# Altium schematic sheet STM32F407VG.SchDoc
size 381 x 241 mm
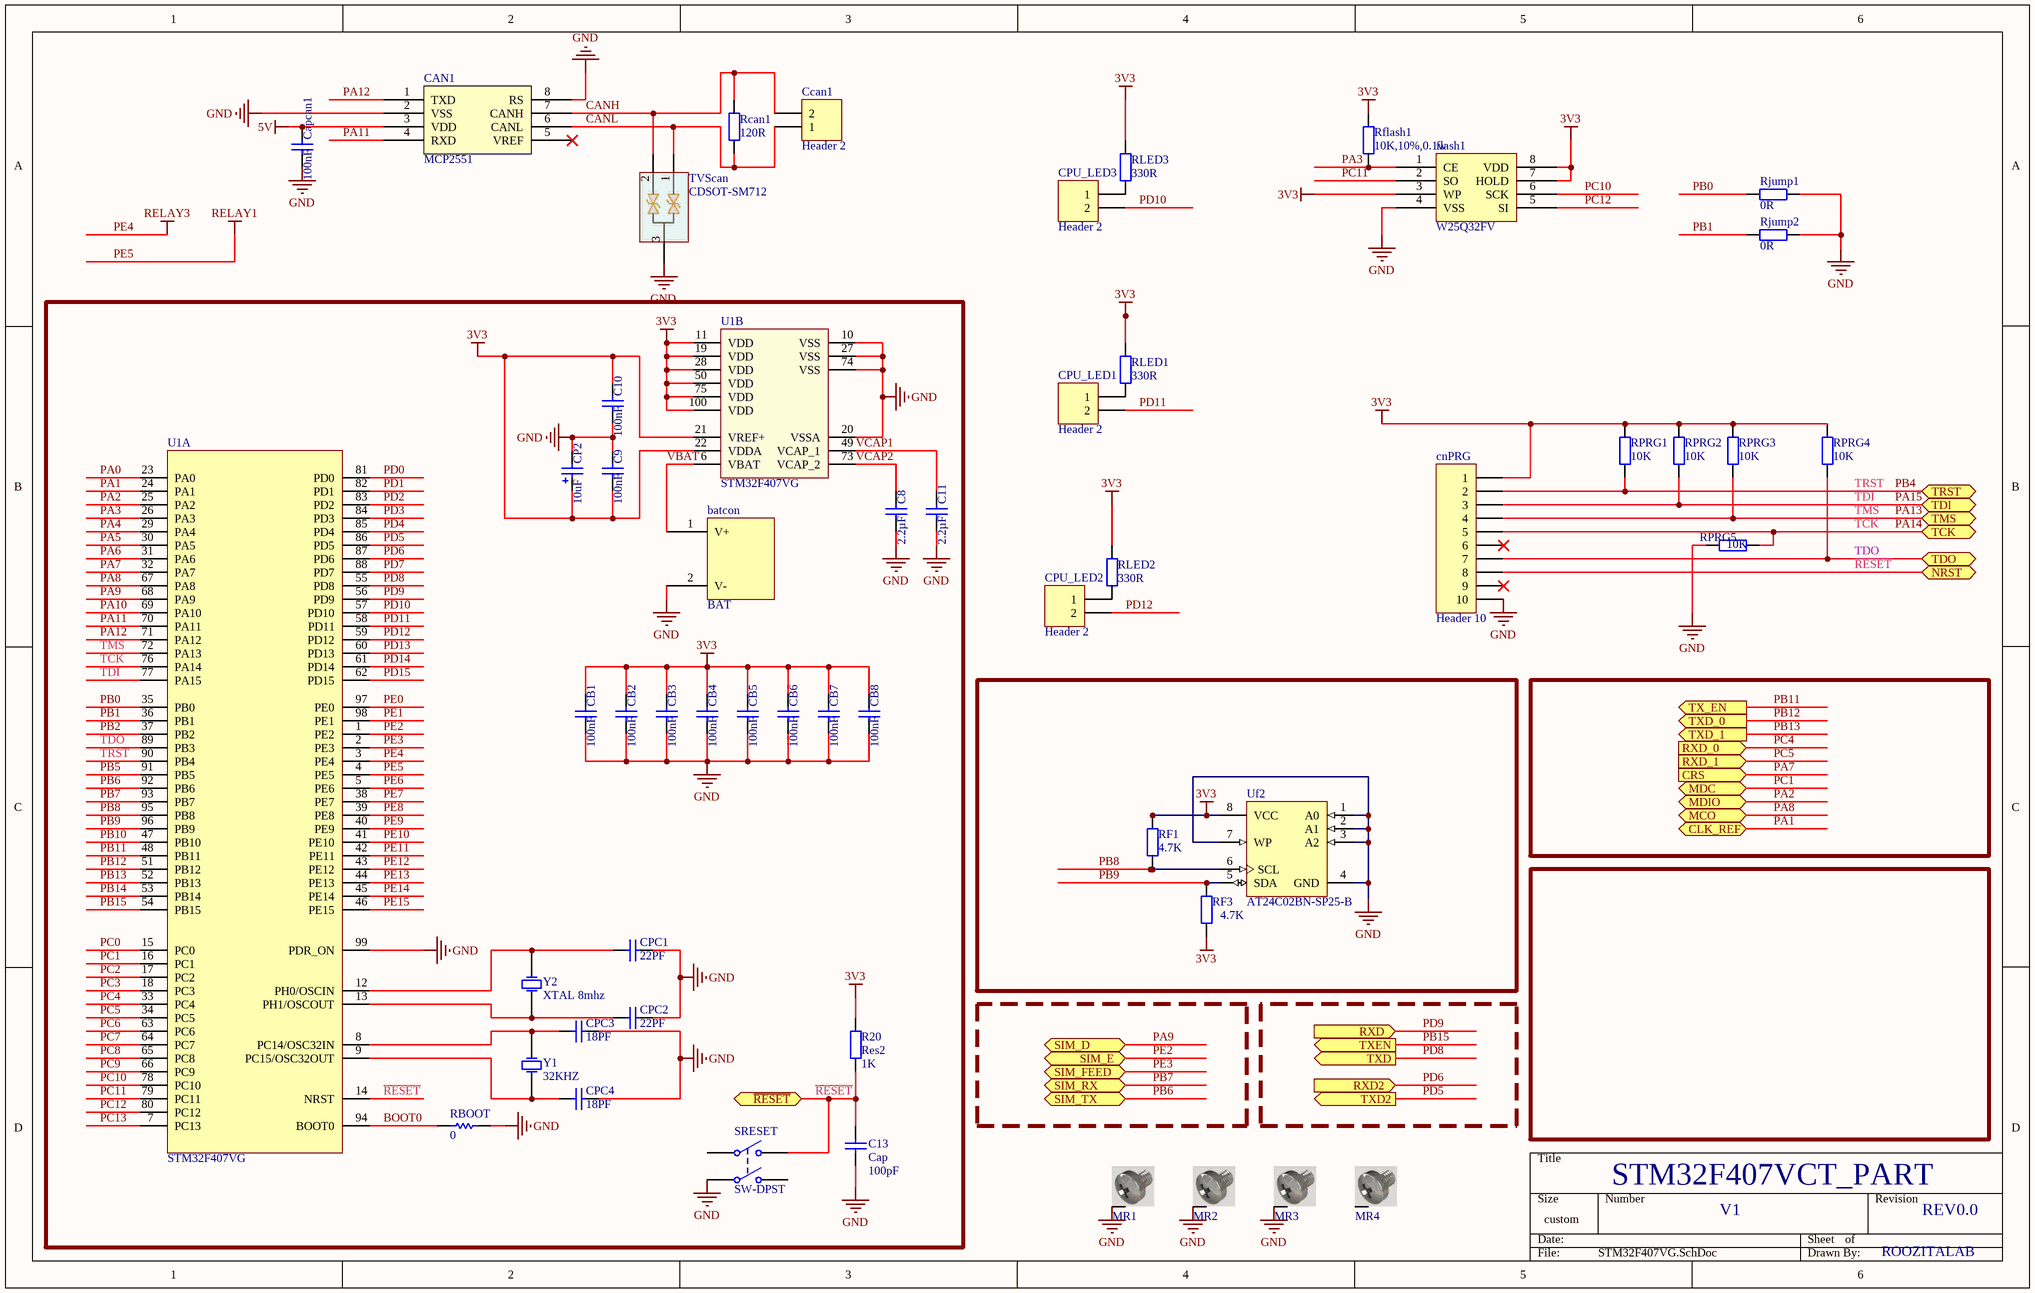
[diagram p0: STM32F407VG.SchDoc]

## Parts
batcon  BAT  [BATTERY]
C8  2.2µF  [0805.]
C9  100nF  [0805.]
C10  100nF  [0805.]
C11  2.2µF  [0805.]
C13  Cap  value 100pF  [0805.]
CAN1  MCP2551  [SOIC8]
Capcan1  100nF  [0805.]
CB1  100nF  [0805.]
CB2  100nF  [0805.]
CB3  100nF  [0805.]
CB4  100nF  [0805.]
CB5  100nF  [0805.]
CB6  100nF  [0805.]
CB7  100nF  [0805.]
CB8  100nF  [0805.]
Ccan1  Header 2  [HDR1X2]
cnPRG  Header 10  [HDR1X10]
CP2  10uF  [C1206.]
CPC1  22PF  [0805.]
CPC2  22PF  [0805.]
CPC3  18PF  [0805.]
CPC4  18PF  [0805.]
CPU_LED1  Header 2  [HDR1X2]
CPU_LED2  Header 2  [HDR1X2]
CPU_LED3  Header 2  [HDR1X2]
flash1  W25Q32FV  [SOIC8]
MR1  Screw  [Board Screw]  (value not drawn)
MR2  Screw  [Board Screw]  (value not drawn)
MR3  Screw  [Board Screw]  (value not drawn)
MR4  Screw  [Board Screw]  (value not drawn)
R20  Res2  value 1K  [0805.]
RBOOT  0  [0805.]
Rcan1  value 120R  [0805.]  (hidden comment: 120R,10%,0.1w)
RF1  value 4.7K  [0805.]  (hidden comment: Res2)
RF3  value 4.7K  [0805.]  (hidden comment: Res2)
Rflash1  10K,10%,0.1w  [0805.]
Rjump1  value 0R  [0805.]  (hidden comment: 10K,10%,0.1w)
Rjump2  value 0R  [0805.]  (hidden comment: 10K,10%,0.1w)
RLED1  value 330R  [0805.]  (hidden comment: 330R,10%,0.1w)
RLED2  value 330R  [0805.]  (hidden comment: 330R,10%,0.1w)
RLED3  value 330R  [0805.]  (hidden comment: 330R,10%,0.1w)
RPRG1  value 10K  [0805.]  (hidden comment: Res2)
RPRG2  value 10K  [0805.]  (hidden comment: Res2)
RPRG3  value 10K  [0805.]  (hidden comment: Res2)
RPRG4  value 10K  [0805.]  (hidden comment: Res2)
RPRG5  value 10K  [0805.]  (hidden comment: Res2)
SRESET  SW-DPST  [B3FS_SWITCH]
TVScan  CDSOT-SM712  [2N3906_SMD]
U1  STM32F407VG  [stm32f107]  (parts A,B of 2)
Uf2  AT24C02BN-SP25-B  [SOP8]
Y1  32KHZ  [XTAL-RTC-RA]
Y2  XTAL 8mhz  [XTAL Small]

## Ports
CLK_REF (bidir), CRS (in), MCO (bidir), MDC (bidir), MDIO (bidir), NRST (bidir), RXD2 (in), RXD (in), RXD_0 (in), RXD_1 (in), SIM_D (bidir), SIM_E (bidir), SIM_FEED (bidir), SIM_RX (bidir), SIM_TX (bidir), TCK (bidir), TDI (bidir), TDO (bidir), TMS (bidir), TRST (bidir), TX_EN (out), TXD2 (out), TXD (out), TXD_0 (out), TXD_1 (out), TXEN (out), ~{RESET} (bidir)

## Nets
3V3: C9.1 C10.2 CB1.2 CB2.2 CB3.2 CB4.2 CB5.2 CB6.2 CB7.2 CB8.2 cnPRG.1 CP2.1 flash1.3(WP) flash1.7(HOLD) flash1.8(VDD) R20.2 RF1.1 RF3.2 Rflash1.1 RLED1.2 RLED2.2 RLED3.2 RPRG1.1 RPRG2.1 RPRG3.1 RPRG4.1 U1.11(VDD) U1.19(VDD) U1.21(VREF+) U1.22(VDDA) U1.28(VDD) U1.50(VDD) U1.75(VDD) U1.100(VDD) Uf2.8(VCC)
5V: CAN1.3(VDD) Capcan1.2
GND: batcon.2(V-) C8.1 C9.2 C10.1 C11.1 C13.1 CAN1.2(VSS) CAN1.8(RS) Capcan1.1 CB1.1 CB2.1 CB3.1 CB4.1 CB5.1 CB6.1 CB7.1 CB8.1 cnPRG.10 CP2.2 CPC1.2 CPC2.2 CPC3.2 CPC4.2 flash1.4(VSS) MR1.S MR2.S MR3.S RBOOT.2 Rjump1.2 Rjump2.2 RPRG5.2 SRESET.3(COMMON2) TVScan.3 U1.10(VSS) U1.20(VSSA) U1.27(VSS) U1.74(VSS) U1.99(PDR_ON) Uf2.1(A0) Uf2.2(A1) Uf2.3(A2) Uf2.4(GND) Uf2.7(WP)
PE4: U1.3(PE4)  [also labelled RELAY3]
PE5: U1.4(PE5)  [also labelled RELAY1]
~{RESET}: C13.2 cnPRG.8 R20.1 SRESET.2(NO1) U1.14(NRST) ; port ~{RESET}, port NRST
BOOT0: RBOOT.1 U1.94(BOOT0)
CANH: CAN1.7(CANH) Ccan1.2 Rcan1.2 TVScan.2
CANL: CAN1.6(CANL) Ccan1.1 Rcan1.1 TVScan.1
PA0: U1.23(PA0)
PA1: U1.24(PA1) ; port CLK_REF
PA2: U1.25(PA2) ; port MDIO
PA3: flash1.1(CE) Rflash1.2 U1.26(PA3)
PA4: U1.29(PA4)
PA5: U1.30(PA5)
PA6: U1.31(PA6)
PA7: U1.32(PA7) ; port CRS
PA8: U1.67(PA8) ; port MCO
PA9: U1.68(PA9) ; port SIM_D
PA10: U1.69(PA10)
PA11: CAN1.4(RXD) U1.70(PA11)
PA12: CAN1.1(TXD) U1.71(PA12)
PA13: cnPRG.4 RPRG3.2 U1.72(PA13) ; port TMS  [also labelled TMS]
PA14: cnPRG.5 RPRG5.1 U1.76(PA14) ; port TCK  [also labelled TCK]
PA15: cnPRG.3 RPRG2.2 U1.77(PA15) ; port TDI  [also labelled TDI]
PB0: Rjump1.1 U1.35(PB0)
PB1: Rjump2.1 U1.36(PB1)
PB2: U1.37(PB2)
PB4: cnPRG.2 RPRG1.2 U1.90(PB4) ; port TRST  [also labelled TRST]
PB5: U1.91(PB5)
PB6: U1.92(PB6) ; port SIM_TX
PB7: U1.93(PB7) ; port SIM_RX
PB8: RF1.2 U1.95(PB8) Uf2.6(SCL)
PB9: RF3.1 U1.96(PB9) Uf2.5(SDA)
PB10: U1.47(PB10)
PB11: U1.48(PB11) ; port TX_EN
PB12: U1.51(PB12) ; port TXD_0
PB13: U1.52(PB13) ; port TXD_1
PB14: U1.53(PB14)
PB15: U1.54(PB15) ; port TXEN
PC0: U1.15(PC0)
PC1: U1.16(PC1) ; port MDC
PC2: U1.17(PC2)
PC3: U1.18(PC3)
PC4: U1.33(PC4) ; port RXD_0
PC5: U1.34(PC5) ; port RXD_1
PC6: U1.63(PC6)
PC7: U1.64(PC7)
PC8: U1.65(PC8)
PC9: U1.66(PC9)
PC10: flash1.6(SCK) U1.78(PC10)
PC11: flash1.2(SO) U1.79(PC11)
PC12: flash1.5(SI) U1.80(PC12)
PC13: U1.7(PC13)
PD0: U1.81(PD0)
PD1: U1.82(PD1)
PD2: U1.83(PD2)
PD3: U1.84(PD3)
PD4: U1.85(PD4)
PD5: U1.86(PD5) ; port TXD2
PD6: U1.87(PD6) ; port RXD2
PD7: U1.88(PD7)
PD8: U1.55(PD8) ; port TXD
PD9: U1.56(PD9) ; port RXD
PD10: CPU_LED3.2 U1.57(PD10)
PD11: CPU_LED1.2 U1.58(PD11)
PD12: CPU_LED2.2 U1.59(PD12)
PD13: U1.60(PD13)
PD14: U1.61(PD14)
PD15: U1.62(PD15)
PE0: U1.97(PE0)
PE1: U1.98(PE1)
PE2: U1.1(PE2) ; port SIM_E
PE3: U1.2(PE3) ; port SIM_FEED
PE6: U1.5(PE6)
PE7: U1.38(PE7)
PE8: U1.39(PE8)
PE9: U1.40(PE9)
PE10: U1.41(PE10)
PE11: U1.42(PE11)
PE12: U1.43(PE12)
PE13: U1.44(PE13)
PE14: U1.45(PE14)
PE15: U1.46(PE15)
TDO: cnPRG.7 RPRG4.2 U1.89(PB3) ; port TDO
VBAT: batcon.1(V+) U1.6(VBAT)
VCAP1: C11.2 U1.49(VCAP_1)
VCAP2: C8.2 U1.73(VCAP_2)
NetCPC1_1: CPC1.1 U1.12(PH0/OSCIN) Y2.2(OSC2)
NetCPC2_1: CPC2.1 U1.13(PH1/OSCOUT) Y2.1(OSC1)
NetCPC3_1: CPC3.1 U1.8(PC14/OSC32IN) Y1.2(OSC2)
NetCPC4_1: CPC4.1 U1.9(PC15/OSC32OUT) Y1.1(OSC1)
NetCPU_LED1_1: CPU_LED1.1 RLED1.1
NetCPU_LED2_1: CPU_LED2.1 RLED2.1
NetCPU_LED3_1: CPU_LED3.1 RLED3.1

Not connected (* = marked no-connect by the designer): CAN1 5(VREF)*; cnPRG 6* 9*; MR4 S; SRESET 1(COMMON1) 4(NO2)

## Notes on the sheet
- STM32F407VCT_PART
- V1
- REV0.0
- ROOZITALAB

## Library data of the parts
C8-C11 C13 Capcan1 CB1-CB8 CPC1-CPC4 = Cap: Capacitor; Published: 8-Jun-2000; LatestRevisionDate: 17-Jul-2002; LatestRevisionNote: Re-released for DXP Platform.; PackageReference: RAD-0.3; Publisher: Altium Limited; PackageDescription: Radial Cap, Thru-Hole; 2 Leads; 0.3 in Pin Spacing
  C8 C11: Value: 2.2µF
  C9 C10 Capcan1 CB1-CB8: Value: 100nF
  CPC1 CPC2: Value: 22PF
  CPC3 CPC4: Value: 18PF
CAN1 = SN65VHD230
Ccan1 CPU_LED1-CPU_LED3 = Header 2: Header, 2-Pin; LatestRevisionDate: 17-Jul-2002; LatestRevisionNote: Re-released for DXP Platform.; Publisher: Altium Limited
cnPRG = Header 10: Header, 10-Pin; LatestRevisionDate: 17-Jul-2002; LatestRevisionNote: Re-released for DXP Platform.; Publisher: Altium Limited
CP2 = Cap Pol1: Polarized Capacitor (Radial); Published: 8-Jun-2000; Revision: July-2002: Re-released for DXP Platform.; Publisher: Altium Limited; Value: 10uF
flash1 = SST25
MR1-MR4 = Board Screw: Board Screw With Spacer
R20 Rcan1 RF1 RF3 Rflash1 Rjump1 Rjump2 RLED1-RLED3 RPRG1-RPRG5 = Res2: Resistor; Published: 8-Jun-2000; LatestRevisionDate: 17-Jul-2002; LatestRevisionNote: Re-released for DXP Platform.; PackageReference: AXIAL-0.4; Publisher: Altium Limited
  R20 RF1 RF3 Rjump1 Rjump2 RPRG1-RPRG5: PackageDescription: Axial Device, Thru-Hole; 2 Leads; 0.4 in Pin Spacing
RBOOT = Res1: Resistor; Value: 1K; Published: 8-Jun-2000; Revision: July-2002: Re-released for DXP Platform.; Publisher: Altium Limited
SRESET = SW-DPST: Double-Pole, Single-Throw Switch; Published: 24-Mar-1999; LatestRevisionDate: 17-Jul-2002; LatestRevisionNote: Re-released for DXP Platform.; PackageReference: DPST-4; Publisher: Altium Limited
TVScan = nup2105
Uf2 = AT24C02BN-SP25-B: 2Kbit (256 x 8), 2-wire Bus Automotive Serial EEPROM with full memory Write Protect, 2.5V, 8-Pin SOIC, Bulk; Published: 20-Sep-2010; DatasheetVersion: 8517C,  Jan-2009; PackageVersion: revC, Mar-2005; PackageReference: 8S1; Publisher: Altium Limited; PackageDescription: 8-Lead (0.150" Wide Body), Plastic Gull Wing Small Outline (JEDEC SOIC); Code_JEDEC: MS-012-AA; Code_IPC: SOIC127P600-8; ComponentLink1Description: Manufacturer Link; ComponentLink1URL: http://www.atmel.com/products/serial/default.asp; ComponentLink2Description: Datasheet; ComponentLink2URL: http://www.atmel.com/dyn/resources/prod_documents/doc8517.pdf; ComponentLink3Description: Atmel.com Home; ComponentLink3URL: http://www.atmel.com
Y1 = XTAL_1: Crystal Oscillator; Published: 8-Jun-2000; LatestRevisionDate: 17-Jul-2002; LatestRevisionNote: Re-released for DXP Platform.; PackageReference: R38; Publisher: Altium Limited
Y2 = XTAL: Crystal Oscillator; Published: 8-Jun-2000; LatestRevisionDate: 17-Jul-2002; LatestRevisionNote: Re-released for DXP Platform.; PackageReference: R38; Publisher: Altium Limited